# Altium schematic sheet Zynq PL.SchDoc
size Tabloid; ApprovedBy: NA
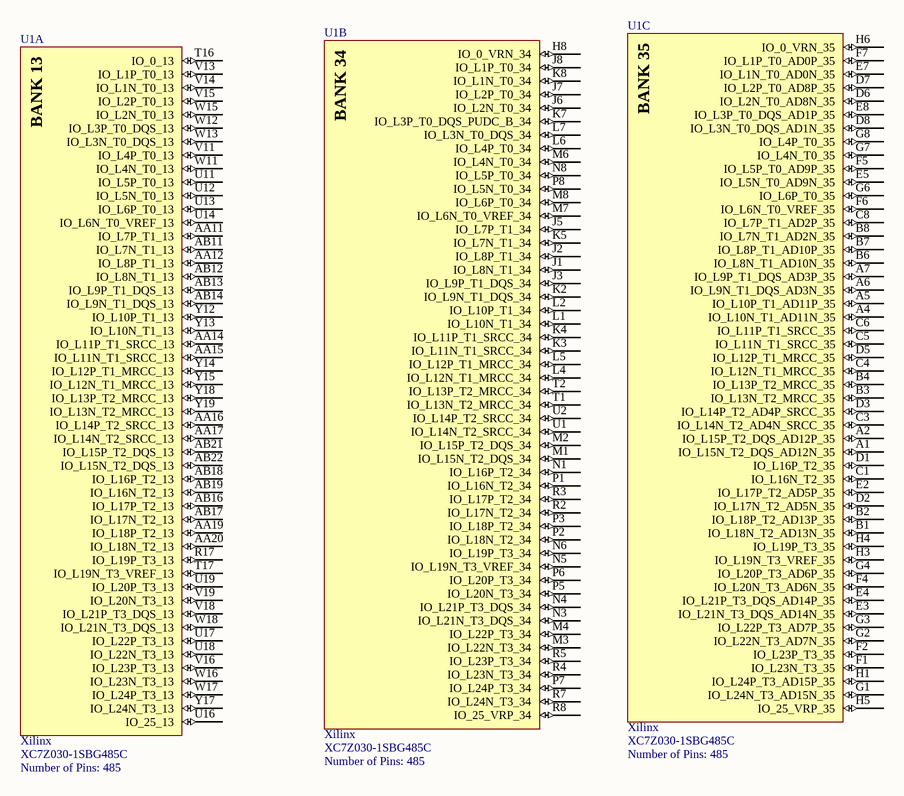
[diagram p0: Zynq PL.SchDoc]

## Parts
U1  Manufacturer: Xilinx  Manufacturer Part Number: XC7Z030-1SBG485C  Number of Pins: 485  [SBG484]  (hidden comment: U_XNLX-XC7Z030-1SBG485C)  (parts A,B,C of 10)

## Nets

Not connected (* = marked no-connect by the designer): U1 A1(IO_L15N_T2_DQS_AD12N_35) A2(IO_L15P_T2_DQS_AD12P_35) A4(IO_L10N_T1_AD11N_35) A5(IO_L10P_T1_AD11P_35) A6(IO_L9N_T1_DQS_AD3N_35) A7(IO_L9P_T1_DQS_AD3P_35) AA11(IO_L7P_T1_13) AA12(IO_L8P_T1_13) AA14(IO_L11P_T1_SRCC_13) AA15(IO_L11N_T1_SRCC_13) AA16(IO_L14P_T2_SRCC_13) AA17(IO_L14N_T2_SRCC_13) AA19(IO_L18P_T2_13) AA20(IO_L18N_T2_13) AB11(IO_L7N_T1_13) AB12(IO_L8N_T1_13) AB13(IO_L9P_T1_DQS_13) AB14(IO_L9N_T1_DQS_13) AB16(IO_L17P_T2_13) AB17(IO_L17N_T2_13) AB18(IO_L16P_T2_13) AB19(IO_L16N_T2_13) AB21(IO_L15P_T2_DQS_13) AB22(IO_L15N_T2_DQS_13) B1(IO_L18N_T2_AD13N_35) B2(IO_L18P_T2_AD13P_35) B3(IO_L13N_T2_MRCC_35) B4(IO_L13P_T2_MRCC_35) B6(IO_L8N_T1_AD10N_35) B7(IO_L8P_T1_AD10P_35) B8(IO_L7N_T1_AD2N_35) C1(IO_L16N_T2_35) C3(IO_L14N_T2_AD4N_SRCC_35) C4(IO_L12N_T1_MRCC_35) C5(IO_L11N_T1_SRCC_35) C6(IO_L11P_T1_SRCC_35) C8(IO_L7P_T1_AD2P_35) D1(IO_L16P_T2_35) D2(IO_L17N_T2_AD5N_35) D3(IO_L14P_T2_AD4P_SRCC_35) D5(IO_L12P_T1_MRCC_35) D6(IO_L2N_T0_AD8N_35) D7(IO_L2P_T0_AD8P_35) D8(IO_L3N_T0_DQS_AD1N_35) E2(IO_L17P_T2_AD5P_35) E3(IO_L21N_T3_DQS_AD14N_35) E4(IO_L21P_T3_DQS_AD14P_35) E5(IO_L5N_T0_AD9N_35) E7(IO_L1N_T0_AD0N_35) E8(IO_L3P_T0_DQS_AD1P_35) F1(IO_L23N_T3_35) F2(IO_L23P_T3_35) F4(IO_L20N_T3_AD6N_35) F5(IO_L5P_T0_AD9P_35) F6(IO_L6N_T0_VREF_35) F7(IO_L1P_T0_AD0P_35) G1(IO_L24N_T3_AD15N_35) G2(IO_L22N_T3_AD7N_35) G3(IO_L22P_T3_AD7P_35) G4(IO_L20P_T3_AD6P_35) G6(IO_L6P_T0_35) G7(IO_L4N_T0_35) G8(IO_L4P_T0_35) H1(IO_L24P_T3_AD15P_35) H3(IO_L19N_T3_VREF_35) H4(IO_L19P_T3_35) H5(IO_25_VRP_35) H6(IO_0_VRN_35) H8(IO_0_VRN_34) J1(IO_L8N_T1_34) J2(IO_L8P_T1_34) J3(IO_L9P_T1_DQS_34) J5(IO_L7P_T1_34) J6(IO_L2N_T0_34) J7(IO_L2P_T0_34) J8(IO_L1P_T0_34) K2(IO_L9N_T1_DQS_34) K3(IO_L11N_T1_SRCC_34) K4(IO_L11P_T1_SRCC_34) K5(IO_L7N_T1_34) K7(IO_L3P_T0_DQS_PUDC_B_34) K8(IO_L1N_T0_34) L1(IO_L10N_T1_34) L2(IO_L10P_T1_34) L4(IO_L12N_T1_MRCC_34) L5(IO_L12P_T1_MRCC_34) L6(IO_L4P_T0_34) L7(IO_L3N_T0_DQS_34) M1(IO_L15N_T2_DQS_34) M2(IO_L15P_T2_DQS_34) M3(IO_L22N_T3_34) M4(IO_L22P_T3_34) M6(IO_L4N_T0_34) M7(IO_L6N_T0_VREF_34) M8(IO_L6P_T0_34) N1(IO_L16P_T2_34) N3(IO_L21N_T3_DQS_34) N4(IO_L21P_T3_DQS_34) N5(IO_L19N_T3_VREF_34) N6(IO_L19P_T3_34) N8(IO_L5P_T0_34) P1(IO_L16N_T2_34) P2(IO_L18N_T2_34) P3(IO_L18P_T2_34) P5(IO_L20N_T3_34) P6(IO_L20P_T3_34) P7(IO_L24P_T3_34) P8(IO_L5N_T0_34) R2(IO_L17N_T2_34) R3(IO_L17P_T2_34) R4(IO_L23N_T3_34) R5(IO_L23P_T3_34) R7(IO_L24N_T3_34) R8(IO_25_VRP_34) R17(IO_L19P_T3_13) T1(IO_L13N_T2_MRCC_34) T2(IO_L13P_T2_MRCC_34) T16(IO_0_13) T17(IO_L19N_T3_VREF_13) U1(IO_L14N_T2_SRCC_34) U2(IO_L14P_T2_SRCC_34) U11(IO_L5P_T0_13) U12(IO_L5N_T0_13) U13(IO_L6P_T0_13) U14(IO_L6N_T0_VREF_13) U16(IO_25_13) U17(IO_L22P_T3_13) U18(IO_L22N_T3_13) U19(IO_L20P_T3_13) V11(IO_L4P_T0_13) V13(IO_L1P_T0_13) V14(IO_L1N_T0_13) V15(IO_L2P_T0_13) V16(IO_L23P_T3_13) V18(IO_L21P_T3_DQS_13) V19(IO_L20N_T3_13) W11(IO_L4N_T0_13) W12(IO_L3P_T0_DQS_13) W13(IO_L3N_T0_DQS_13) W15(IO_L2N_T0_13) W16(IO_L23N_T3_13) W17(IO_L24P_T3_13) W18(IO_L21N_T3_DQS_13) Y12(IO_L10P_T1_13) Y13(IO_L10N_T1_13) Y14(IO_L12P_T1_MRCC_13) Y15(IO_L12N_T1_MRCC_13) Y17(IO_L24N_T3_13) Y18(IO_L13P_T2_MRCC_13) Y19(IO_L13N_T2_MRCC_13)

## Notes on the sheet
- Project:
- http://www.cospandesign.com
- Cospan Design
- Document:
- Engineer:
- Title:
- Client:
- Approved By:
- Revision:
- Date:
- Number:
- of
- (in symbol U_XNLX-XC7Z030-1SBG485C, part A) BANK 13
- (in symbol U_XNLX-XC7Z030-1SBG485C, part B) BANK 34
- (in symbol U_XNLX-XC7Z030-1SBG485C, part C) BANK 35

## Library data of the parts
U1 = U_XNLX-XC7Z030-1SBG485C: MPU Zynq-7000 RISC 32-Bit 667MHz 1.5V/2V/2.5V 485-Pin FBGA; Speed Grade: -1; RAM Size: 256KB; Number of I/Os: 130; Interface: I2C,SPI,USB,CAN,Ethernet,MMC,SDIO,SD,UART,USART,EBI/EMI; Data Bus Width: 32b; Peripherals: DMA; Supplier 1: Digikey; Stock 1: 102; Pricing 1: 1=230.1 (USD); Case/Package: FBGA; Contact Plating: Copper,Tin,Silver; Min Operating Temperature: 0°C; Max Operating Temperature: 85°C; Packaging: Tray; Frequency: 667MHz; Max Frequency: 667MHz; ComponentLink1URL: https://datasheet.ciiva.com/48476/ds190-zynq-7000-overview-48476904.pdf; ComponentLink1Description: https://datasheet.ciiva.com/48476/ds190-zynq-7000-overview-48476904.pdf; Supplier Part Number 1: 122-1924-ND